# EAGLE schematic SENSOR_BOARD (EAGLE 9.5.2)
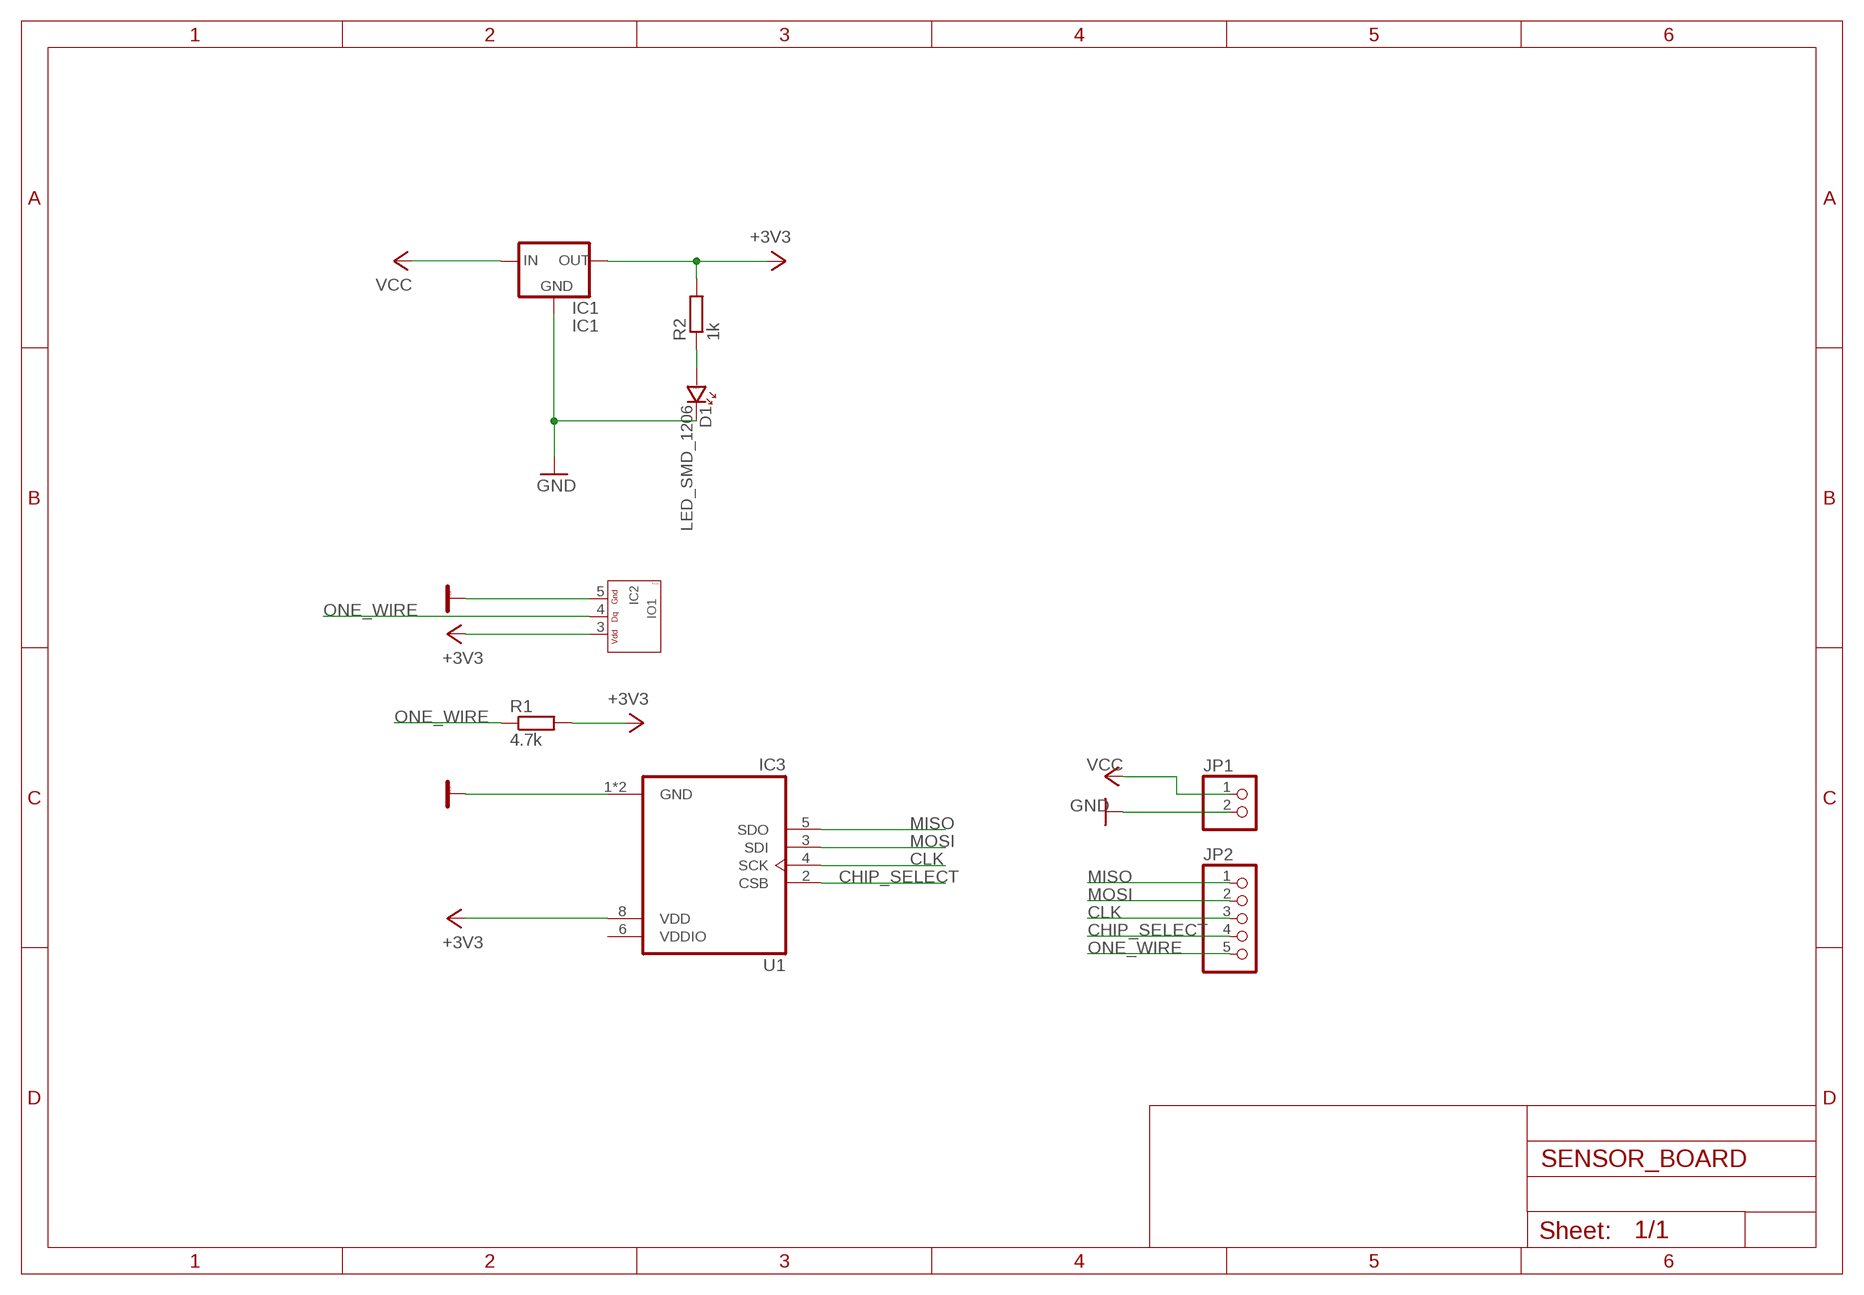
[diagram p0: schematic, sheet 1]

## Parts
D1  LED_SMD_1206  [P1206]
IC1  IC1  LM1117MP-3.3  [SOT223]
IO1  IC2  DS18B20_SO8  [SO08]
JP1  PINHD-1X2  [1X02]
JP2  PINHD-1X5  [1X05]
R1  4.7k  R-EU_R0603  [R0603]
R2  1k  R-EU_R0603  [R0603]
U1  IC3  BME280  [PSON65P250X250X100-8N]

## Nets
+3V3: IC1.2(OUT) IC1.4(OUT) IO1.3(+VCC) R1.2 R2.2 U1.8(VDD)
CHIP_SELECT: JP2.4 U1.2(CSB)
CLK: JP2.3 U1.4(SCK)
GND: D1.K IC1.1(GND) IO1.5(GND) JP1.2 U1.1(GND) U1.7(GND)
MISO: JP2.1 U1.5(SDO)
MOSI: JP2.2 U1.3(SDI)
N$1: D1.A R2.1
ONE_WIRE: IO1.4(1WIRE) JP2.5 R1.1
VCC: IC1.3(IN) JP1.1

## Power pins joined to a net without a drawn wire
VDDIO: U1.6(VDDIO)

## Library data of the parts
D1 = #PaJa_30:LED: LED - jednobarevna
IC1 = lm1117:LM1117?-*: 800mA Low-Dropout Linear Regulator Source: http://ww1.microchip.com/downloads/en/DeviceDoc/39760d.pdf; MF: Texas Instruments; MPN: LM1117MP-3.3; OC_FARNELL: 9778195; OC_NEWARK: 28X3416
IO1 = #PaJa_30:DS18B20: DS18B20 - teplomer, 1wire (-55 az 125°C)
JP1 = pinhead:PINHD-1X2: PIN HEADER
JP2 = pinhead:PINHD-1X5: PIN HEADER
R1 R2 = rcl_upravena:R-EU_: RESISTOR, European symbol
U1 = BME280:BME280: DIGITAL HUMIDITY, PRESSURE AND TEMPERATURE SENSOR * Digital interface I²C (up to 3.4 MHz) and SPI (3 and 4 wire, up to 10 MHz)* Supply voltage VDD main supply voltage range: 1.71 V to 3.6 V*VDDIO interface voltage range: 1.2 V to 3.6 V Operating range -40…+85 °C, 0…100 % rel. humidity, 300…1100 hPa The library has been designed by Richard Magdycz <https://www.facebook.com/groups/eaglecadsoftUK>; AVAILABILITY: Unavailable; DESCRIPTION: Humidity Temperature Sensor 0 ~ 100% RH I²C, SPI ±3% 1s Surface Mount; MF: Bosch; MP: BME280; PACKAGE: LGA-8 Bosch; PRICE: None